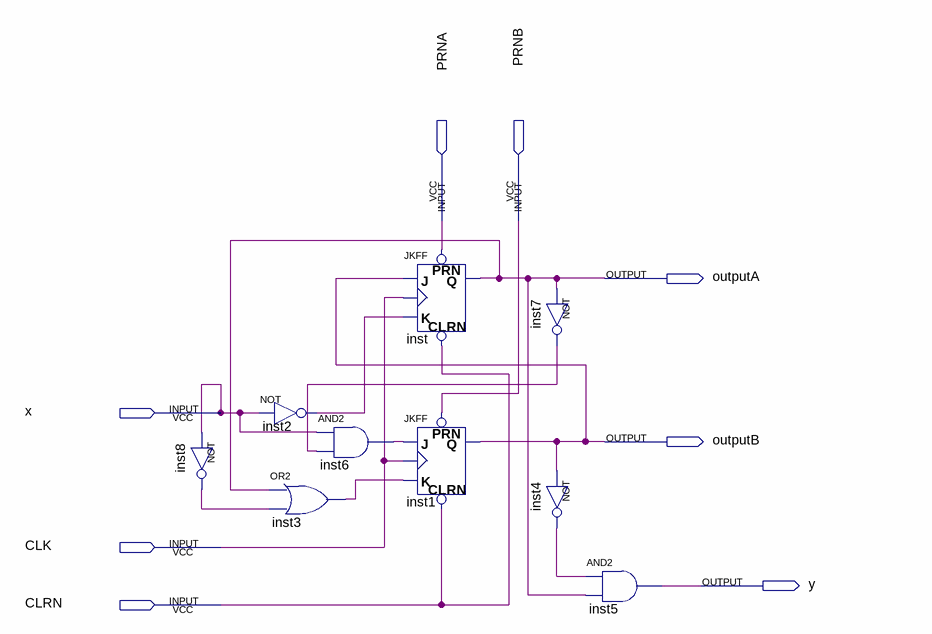
[diagram p0: schematic sheet]
// Quartus schematic test1.bdf as structural Verilog: 9 symbols, 8 pins
module test1 (
  input  PRNA,
  input  PRNB,
  input  x,
  input  CLK,
  input  CLRN,
  output outputA,
  output outputB,
  output y
);

  wire inst2_out, inst3_out, inst4_out, inst6_out, inst7_out, inst8_out;

  not inst8 (inst8_out, x);
  not inst2 (inst2_out, x);
  and inst6 (inst6_out, x, inst7_out);
  or inst3 (inst3_out, outputA, inst8_out);
  JKFF inst (.PRN(PRNA), .CLRN(CLRN), .K(inst2_out), .J(outputB), .CLK(CLK), .Q(outputA));
  JKFF inst1 (.PRN(PRNB), .CLRN(CLRN), .K(inst3_out), .J(inst6_out), .CLK(CLK), .Q(outputB));
  not inst7 (inst7_out, outputA);
  not inst4 (inst4_out, outputB);
  and inst5 (y, inst4_out, outputA);
endmodule
